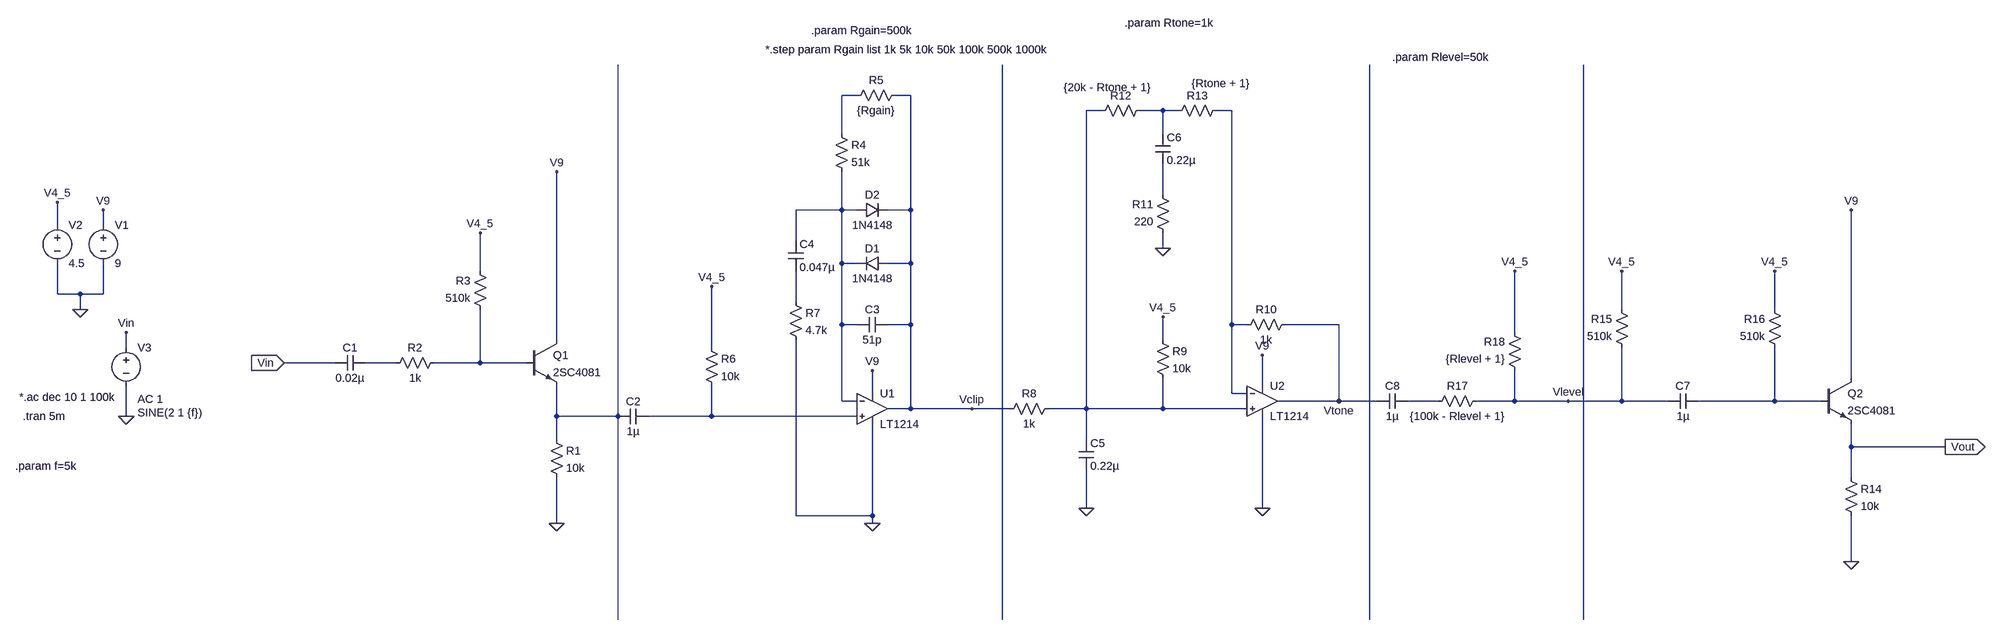
[diagram p0: schematic ts808.asc]
ts808.asc, the LTspice schematic file:
Version 4
SHEET 1 3248 804
WIRE 816 -416 784 -416
WIRE 928 -416 896 -416
WIRE 1328 -384 1296 -384
WIRE 1456 -384 1408 -384
WIRE 1488 -384 1456 -384
WIRE 1600 -384 1568 -384
WIRE 784 -336 784 -416
WIRE 1456 -336 1456 -384
WIRE 1456 -208 1456 -272
WIRE 784 -176 784 -256
WIRE 784 -176 688 -176
WIRE 816 -176 784 -176
WIRE 928 -176 928 -416
WIRE 928 -176 880 -176
WIRE -1072 -144 -1072 -192
WIRE -976 -144 -976 -176
WIRE 688 -112 688 -176
WIRE 1456 -96 1456 -128
WIRE 784 -64 784 -176
WIRE 816 -64 784 -64
WIRE 928 -64 928 -176
WIRE 928 -64 880 -64
WIRE 16 -48 16 -128
WIRE -1072 0 -1072 -64
WIRE -1024 0 -1072 0
WIRE -976 0 -976 -64
WIRE -976 0 -1024 0
WIRE 688 16 688 -48
WIRE -1024 32 -1024 0
WIRE 2416 32 2416 -48
WIRE 2736 32 2736 -48
WIRE 784 64 784 -64
WIRE 816 64 784 64
WIRE 928 64 928 -64
WIRE 928 64 880 64
WIRE 1600 64 1600 -384
WIRE 1632 64 1600 64
WIRE 1824 64 1712 64
WIRE 2192 80 2192 -48
WIRE 176 96 176 -256
WIRE 1456 96 1456 48
WIRE -928 112 -928 80
WIRE 512 112 512 -16
WIRE -288 144 -416 144
WIRE -160 144 -224 144
WIRE 16 144 16 32
WIRE 16 144 -80 144
WIRE 112 144 16 144
WIRE 2896 176 2896 -176
WIRE 1664 192 1664 128
WIRE 848 208 848 160
WIRE 1600 208 1600 64
WIRE 1632 208 1600 208
WIRE 784 224 784 64
WIRE 816 224 784 224
WIRE 1824 224 1824 64
WIRE 1824 224 1696 224
WIRE 1904 224 1824 224
WIRE 2032 224 1968 224
WIRE 2192 224 2192 160
WIRE 2192 224 2112 224
WIRE 2304 224 2192 224
WIRE 2416 224 2416 112
WIRE 2416 224 2304 224
WIRE 2512 224 2416 224
WIRE 2736 224 2736 112
WIRE 2736 224 2576 224
WIRE 2832 224 2736 224
WIRE 928 240 928 64
WIRE 928 240 880 240
WIRE 1056 240 928 240
WIRE 1136 240 1056 240
WIRE 1296 240 1296 -384
WIRE 1296 240 1216 240
WIRE 1456 240 1456 176
WIRE 1456 240 1296 240
WIRE 1632 240 1456 240
WIRE -928 256 -928 192
WIRE 176 256 176 192
WIRE 304 256 304 -480
WIRE 304 256 176 256
WIRE 512 256 512 192
WIRE 512 256 368 256
WIRE 816 256 512 256
WIRE 176 304 176 256
WIRE 1296 304 1296 240
WIRE 2896 320 2896 272
WIRE 3136 320 2896 320
WIRE 2896 384 2896 320
WIRE 1296 448 1296 368
WIRE 1664 448 1664 256
WIRE 688 464 688 96
WIRE 848 464 848 272
WIRE 848 464 688 464
WIRE 176 480 176 384
WIRE 848 480 848 464
WIRE 2896 560 2896 464
WIRE 304 800 304 256
WIRE 1120 800 1120 -480
WIRE 1888 800 1888 -480
WIRE 2336 800 2336 -480
FLAG 16 -128 V4_5
FLAG 176 -256 V9
FLAG -416 144 Vin
IOPIN -416 144 In
FLAG 176 480 0
FLAG -928 256 0
FLAG -1024 32 0
FLAG -1072 -192 V4_5
FLAG -976 -176 V9
FLAG -928 80 Vin
FLAG 848 160 V9
FLAG 512 -16 V4_5
FLAG 848 480 0
FLAG 1056 240 Vclip
FLAG 1664 448 0
FLAG 1296 448 0
FLAG 1456 -96 0
FLAG 1664 128 V9
FLAG 1456 48 V4_5
FLAG 1824 224 Vtone
FLAG 2736 -48 V4_5
FLAG 2896 -176 V9
FLAG 2896 560 0
FLAG 2416 -48 V4_5
FLAG 2192 -48 V4_5
FLAG 2304 224 Vlevel
FLAG 3136 320 Vout
IOPIN 3136 320 Out
SYMBOL npn 112 96 R0
SYMATTR InstName Q1
SYMATTR Value 2SC4081
SYMBOL res 160 288 R0
SYMATTR InstName R1
SYMATTR Value 10k
SYMBOL res -64 128 R90
WINDOW 0 0 56 VBottom 2
WINDOW 3 32 56 VTop 2
SYMATTR InstName R2
SYMATTR Value 1k
SYMBOL res 32 48 R180
WINDOW 0 36 76 Left 2
WINDOW 3 36 40 Left 2
SYMATTR InstName R3
SYMATTR Value 510k
SYMBOL cap -224 128 R90
WINDOW 0 0 32 VBottom 2
WINDOW 3 32 32 VTop 2
SYMATTR InstName C1
SYMATTR Value 0.02µ
SYMBOL cap 368 240 R90
WINDOW 0 0 32 VBottom 2
WINDOW 3 32 32 VTop 2
SYMATTR InstName C2
SYMATTR Value 1µ
SYMBOL voltage -976 -160 R0
WINDOW 123 0 0 Left 0
WINDOW 39 0 0 Left 0
SYMATTR InstName V1
SYMATTR Value 9
SYMBOL voltage -1072 -160 R0
WINDOW 123 0 0 Left 0
WINDOW 39 0 0 Left 0
SYMATTR InstName V2
SYMATTR Value 4.5
SYMBOL voltage -928 96 R0
WINDOW 3 24 152 Left 2
WINDOW 123 24 124 Left 2
WINDOW 39 0 0 Left 0
SYMATTR Value SINE(2 1 {f})
SYMATTR Value2 AC 1
SYMATTR InstName V3
SYMBOL Opamps\\LT1214 848 176 R0
SYMATTR InstName U1
SYMBOL cap 880 48 R90
WINDOW 0 0 32 VBottom 2
WINDOW 3 32 32 VTop 2
SYMATTR InstName C3
SYMATTR Value 51p
SYMBOL res 768 -352 R0
SYMATTR InstName R4
SYMATTR Value 51k
SYMBOL res 912 -432 R90
WINDOW 0 0 56 VBottom 2
WINDOW 3 32 56 VTop 2
SYMATTR InstName R5
SYMATTR Value {Rgain}
SYMBOL res 496 96 R0
SYMATTR InstName R6
SYMATTR Value 10k
SYMBOL res 672 0 R0
SYMATTR InstName R7
SYMATTR Value 4.7k
SYMBOL cap 672 -112 R0
SYMATTR InstName C4
SYMATTR Value 0.047µ
SYMBOL diode 880 -80 R90
WINDOW 0 0 32 VBottom 2
WINDOW 3 32 32 VTop 2
SYMATTR InstName D1
SYMATTR Value 1N4148
SYMBOL Opamps\\LT1214 1664 160 R0
SYMATTR InstName U2
SYMBOL res 1232 224 R90
WINDOW 0 0 56 VBottom 2
WINDOW 3 32 56 VTop 2
SYMATTR InstName R8
SYMATTR Value 1k
SYMBOL cap 1280 304 R0
SYMATTR InstName C5
SYMATTR Value 0.22µ
SYMBOL res 1440 80 R0
SYMATTR InstName R9
SYMATTR Value 10k
SYMBOL res 1728 48 R90
WINDOW 0 0 56 VBottom 2
WINDOW 3 32 56 VTop 2
SYMATTR InstName R10
SYMATTR Value 1k
SYMBOL res 1472 -112 R180
WINDOW 0 36 76 Left 2
WINDOW 3 36 40 Left 2
SYMATTR InstName R11
SYMATTR Value 220
SYMBOL cap 1440 -336 R0
SYMATTR InstName C6
SYMATTR Value 0.22µ
SYMBOL res 1424 -400 R90
WINDOW 0 0 56 VBottom 2
WINDOW 3 -48 84 VTop 2
SYMATTR InstName R12
SYMATTR Value {20k - Rtone + 1}
SYMBOL res 1584 -400 R90
WINDOW 0 0 56 VBottom 2
WINDOW 3 -57 7 VTop 2
SYMATTR InstName R13
SYMATTR Value {Rtone + 1}
SYMBOL diode 816 -192 M90
WINDOW 0 0 32 VBottom 2
WINDOW 3 32 32 VTop 2
SYMATTR InstName D2
SYMATTR Value 1N4148
SYMBOL npn 2832 176 R0
SYMATTR InstName Q2
SYMATTR Value 2SC4081
SYMBOL res 2880 368 R0
SYMATTR InstName R14
SYMATTR Value 10k
SYMBOL res 2752 128 R180
WINDOW 0 36 76 Left 2
WINDOW 3 36 40 Left 2
SYMATTR InstName R16
SYMATTR Value 510k
SYMBOL cap 2576 208 R90
WINDOW 0 0 32 VBottom 2
WINDOW 3 32 32 VTop 2
SYMATTR InstName C7
SYMATTR Value 1µ
SYMBOL res 2432 128 R180
WINDOW 0 36 76 Left 2
WINDOW 3 36 40 Left 2
SYMATTR InstName R15
SYMATTR Value 510k
SYMBOL cap 1968 208 R90
WINDOW 0 0 32 VBottom 2
WINDOW 3 32 32 VTop 2
SYMATTR InstName C8
SYMATTR Value 1µ
SYMBOL res 2128 208 R90
WINDOW 0 0 56 VBottom 2
WINDOW 3 32 56 VTop 2
SYMATTR InstName R17
SYMATTR Value {100k - Rlevel + 1}
SYMBOL res 2208 176 R180
WINDOW 0 36 76 Left 2
WINDOW 3 36 40 Left 2
SYMATTR InstName R18
SYMATTR Value {Rlevel + 1}
TEXT -1152 216 Left 2 !*.ac dec 10 1 100k
TEXT 720 -552 Left 2 !.param Rgain=500k
TEXT 624 -512 Left 2 !*.step param Rgain list 1k 5k 10k 50k 100k 500k 1000k
TEXT -1144 256 Left 2 !.tran 5m
TEXT -1160 360 Left 2 !.param f=5k
TEXT 1376 -568 Left 2 !.param Rtone=1k
TEXT 1936 -496 Left 2 !.param Rlevel=50k

The netlist it stands for:
* ts808.asc
Q1 V9 N009 N012 0 2SC4081
R1 N012 0 10k
R2 N009 N008 1k
R3 N009 V4_5 510k
C1 N008 Vin 0.02µ
C2 N013 N012 1µ
V1 V9 0 9
V2 V4_5 0 4.5
V3 Vin 0 SINE(2 1 {f}) AC 1
XU1 N013 N006 V9 0 Vclip LT1213  ; LT1214, pins In+ In- V+ V- OUT
C3 Vclip N006 51p
R4 N001 N006 51k
R5 Vclip N001 {Rgain}
R6 V4_5 N013 10k
R7 N007 0 4.7k
C4 N006 N007 0.047µ
D1 Vclip N006 1N4148
XU2 N002 N004 V9 0 Vtone LT1213  ; LT1214, pins In+ In- V+ V- OUT
R8 N002 Vclip 1k
C5 N002 0 0.22µ
R9 V4_5 N002 10k
R10 Vtone N004 1k
R11 0 N005 220
C6 N003 N005 0.22µ
R12 N003 N002 {20k - Rtone + 1}
R13 N004 N003 {Rtone + 1}
D2 N006 Vclip 1N4148
Q2 V9 N011 Vout 0 2SC4081
R14 Vout 0 10k
R16 N011 V4_5 510k
C7 N011 Vlevel 1µ
R15 Vlevel V4_5 510k
C8 N010 Vtone 1µ
R17 Vlevel N010 {100k - Rlevel + 1}
R18 Vlevel V4_5 {Rlevel + 1}
.model D D
.lib standard.dio
.model NPN NPN
.model PNP PNP
.lib standard.bjt
*.ac dec 10 1 100k
.param Rgain=500k
*.step param Rgain list 1k 5k 10k 50k 100k 500k 1000k
.tran 5m
.param f=5k
.param Rtone=1k
.param Rlevel=50k
.lib LTC.lib
.backanno
.end